# Altium schematic sheet Last project.SchDoc
size A; SheetNumber: 1; SheetTotal: 2
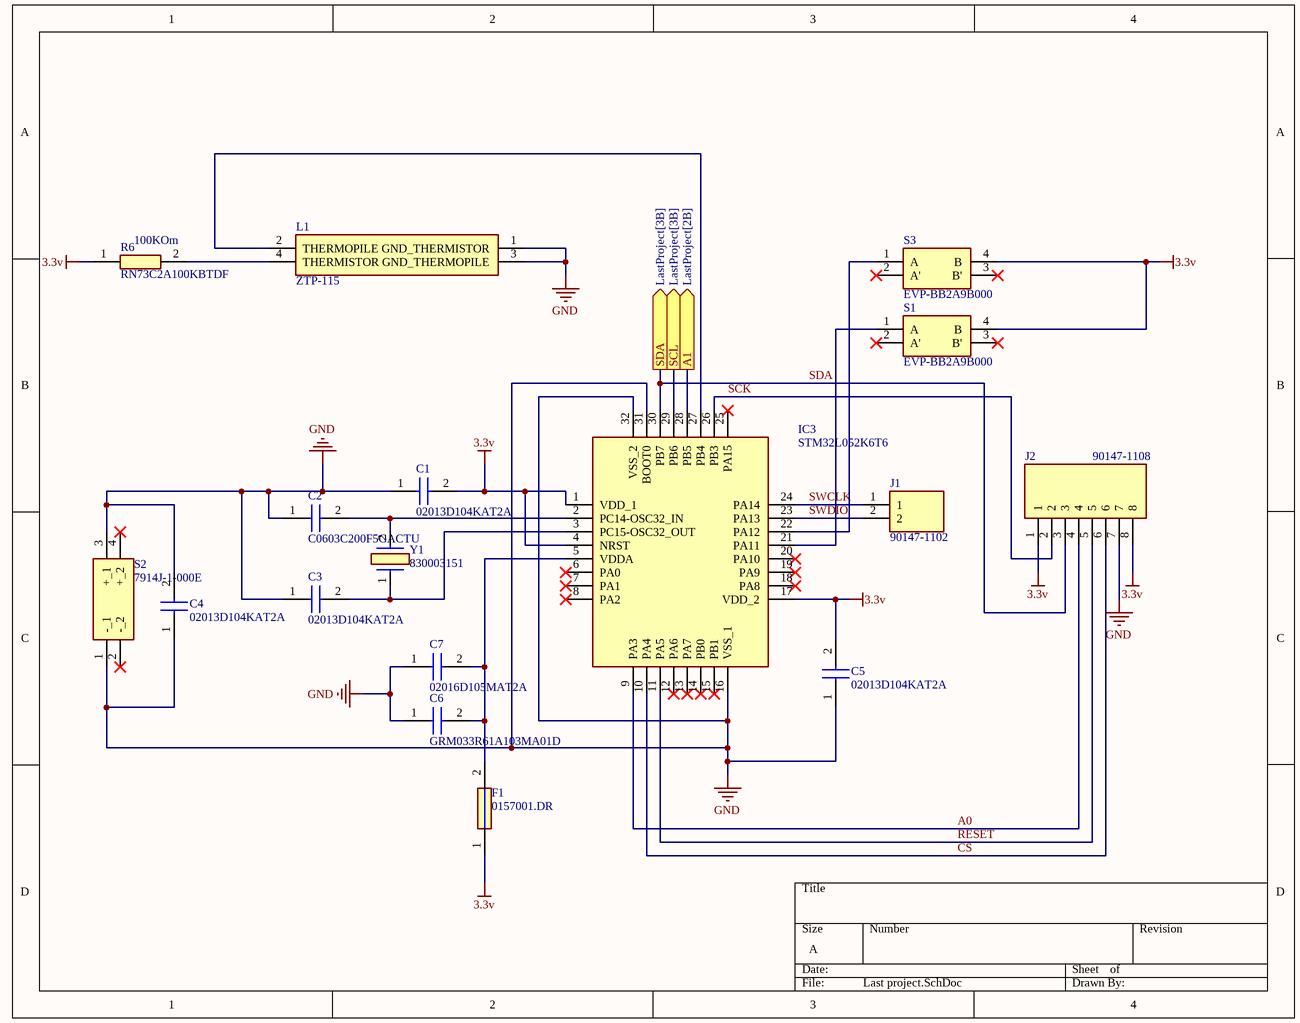
[diagram p0: Last project.SchDoc]

## Parts
C1  02013D104KAT2A  [CAPC0603X33N]
C2  C0603C200F5GACTU  [CAPC1608X87N]
C3  02013D104KAT2A  [CAPC0603X33N]
C4  02013D104KAT2A  [CAPC0603X33N]
C5  02013D104KAT2A  [CAPC0603X33N]
C6  GRM033R61A103MA01D  [GRM033D70J224ME01D]
C7  02016D105MAT2A  [CAPC0603X33N]
F1  0157001.DR  [FUSC6537X403N]
IC3  STM32L052K6T6  [QFP80P900X900X160-32N]
J1  90147-1102  [RHDR2W70P0X254_1X2_493X244X870P]
J2  90147-1108  [RHDR8W70P0X254_1X8_2017X244X870P]
L1  ZTP-115  [ZTP115]
R6  RN73C2A100KBTDF  [RESC2012X65N]
S1  EVP-BB2A9B000  [EVPBB2A9B000]
S2  7914J-1-000E  [7914J1000E]
S3  EVP-BB2A9B000  [EVPBB2A9B000]
Y1  830003151  [830003151]

## Ports
A1 (out, see LastProject[2B]), SCL (out, see LastProject[3B]), SDA (out, see LastProject[3B])

## Nets
3.3v: C1.2 C5.2 F1.1 IC3.1(VDD_1) IC3.4(NRST) IC3.17(VDD_2) J2.1 J2.8 R6.1 S1.4(B) S3.4(B)
GND: C1.1 C2.1 C3.1 C4.1 C4.2 C5.1 C6.1 C7.1 IC3.16(VSS_1) IC3.31(BOOT0) IC3.32(VSS_2) J2.7 L1.1(GND_THERMISTOR) L1.3(GND_THERMOPILE) S2.1(-_1) S2.3(+_1)
A0: IC3.9(PA3) J2.4
A1: IC3.28(PB5) ; port A1
CS: IC3.10(PA4) J2.6
RESET: IC3.11(PA5) J2.5
SCK: IC3.26(PB3) J2.2
SCL: IC3.29(PB6) ; port SCL
SDA: IC3.30(PB7) J2.3 ; port SDA
SWCLK: IC3.24(PA14) J1.1
SWDIO: IC3.23(PA13) J1.2
NetC2_2: C2.2 IC3.2(PC14-OSC32_IN) Y1.2
NetC3_2: C3.2 IC3.3(PC15-OSC32_OUT) Y1.1
NetC6_2: C6.2 C7.2 F1.2 IC3.5(VDDA)
NetIC3_21: IC3.21(PA11) S1.1(A)
NetIC3_22: IC3.22(PA12) S3.1(A)
NetIC3_27: IC3.27(PB4) L1.2(THERMOPILE)
NetL1_4: L1.4(THERMISTOR) R6.2

Not connected (* = marked no-connect by the designer): IC3 6(PA0)* 7(PA1)* 8(PA2)* 12(PA6)* 13(PA7)* 14(PB0)* 15(PB1)* 18(PA8)* 19(PA9)* 20(PA10)* 25(PA15)*; S1 2(A')* 3(B')*; S2 2(-_2)* 4(+_2)*; S3 2(A')* 3(B')*

## Notes on the sheet
- (near R6) 100KOm

## Library data of the parts
C1 C3-C5 = 02013D104KAT2A: Capacitor; Manufacturer_Name: Kyocera AVX; Datasheet Link: http://www.mouser.com/catalog/supplier/library/pdf/AVXSurfaceMountCeramic.pdf; Height: 0.33mm; Manufacturer_Part_Number: 02013D104KAT2A; Mouser Part Number: 581-02013D104KAT2A; Mouser Price/Stock: https://www.mouser.co.uk/ProductDetail/KYOCERA-AVX/02013D104KAT2A?qs=%252BdQmOuGyFcEnhMAg1ZoBSQ%3D%3D
C2 = C0603C200F5GACTU: Capacitor; Manufacturer_Name: KEMET; Datasheet Link: https://content.kemet.com/datasheets/KEM_C1003_C0G_SMD.pdf; Height: 0.87mm; Manufacturer_Part_Number: C0603C200F5GACTU; Mouser Part Number: 80-C0603C200F5GACTU; Mouser Price/Stock: https://www.mouser.co.uk/ProductDetail/KEMET/C0603C200F5GACTU?qs=gt1LBUVyoHmxLY5yAwiOrg%3D%3D; Arrow Part Number: C0603C200F5GACTU; Arrow Price/Stock: https://www.arrow.com/en/products/c0603c200f5gactu/kemet-corporation
C6 = GRM033R61A103MA01D: Capacitor; Manufacturer_Name: Murata Electronics; Datasheet Link: https://search.murata.co.jp/Ceramy/image/img/A01X/G101/ENG/GRM033R61A103MA01-01A.pdf; Height: 0.5mm; Manufacturer_Part_Number: GRM033R61A103MA01D; Mouser Part Number: 81-GRM033R61A103MA1D; Mouser Price/Stock: https://www.mouser.com/Search/Refine.aspx?Keyword=81-GRM033R61A103MA1D; Arrow Part Number: GRM033R61A103MA01D; Arrow Price/Stock: https://www.arrow.com/en/products/grm033r61a103ma01d/murata-manufacturing
C7 = 02016D105MAT2A: Capacitor; Manufacturer_Name: Kyocera AVX; Datasheet Link: http://www.mouser.com/catalog/supplier/library/pdf/AVXSurfaceMountCeramic.pdf; Height: 0.33mm; Manufacturer_Part_Number: 02016D105MAT2A; Mouser Part Number: 581-02016D105MAT2A; Mouser Price/Stock: https://www.mouser.co.uk/ProductDetail/KYOCERA-AVX/02016D105MAT2A?qs=RC%2FTMc7rOJYRv3ejaJ2Ykg%3D%3D; Arrow Part Number: 02016D105MAT2A; Arrow Price/Stock: https://www.arrow.com/en/products/02016d105mat2a/avx?region=nac
F1 = 0157001.DR: Fuse; Manufacturer_Name: LITTELFUSE; Datasheet Link: https://m.littelfuse.com/~/media/electronics/datasheets/fuses/littelfuse_fuse_157_datasheet.pdf.pdf; Height: 4.03mm; Manufacturer_Part_Number: 0157001.DR; Mouser Part Number: 576-0157001.DR; Mouser Price/Stock: https://www.mouser.co.uk/ProductDetail/Littelfuse/0157001.DR?qs=n5MbhIql%252BRnvbSAA7u9U9A%3D%3D; Arrow Part Number: 0157001.DR; Arrow Price/Stock: https://www.arrow.com/en/products/0157001.dr/littelfuse?region=nac
IC3 = STM32L052K6T6: Integrated Circuit; Manufacturer_Name: STMicroelectronics; Datasheet Link: https://www.st.com/resource/en/datasheet/stm32l052k6.pdf; Height: 1.6mm; Manufacturer_Part_Number: STM32L052K6T6; Mouser Part Number: 511-STM32L052K6T6; Mouser Price/Stock: https://www.mouser.co.uk/ProductDetail/STMicroelectronics/STM32L052K6T6?qs=s5SkPsIz108xCpQ1lakLfA%3D%3D; Arrow Part Number: STM32L052K6T6; Arrow Price/Stock: https://www.arrow.com/en/products/stm32l052k6t6/stmicroelectronics
J1 = 90147-1102: Connector; Manufacturer_Name: Molex; Datasheet Link: https://componentsearchengine.com/Datasheets/1/90147-1102.pdf; Height: 8.7mm; Manufacturer_Part_Number: 90147-1102; Mouser Part Number: 538-90147-1102; Mouser Price/Stock: https://www.mouser.co.uk/ProductDetail/Molex/90147-1102?qs=QESXi79X%252BKphYEszDmsGRw%3D%3D
J2 = 90147-1108: Connector; Manufacturer_Name: Molex; Datasheet Link: https://www.molex.com/pdm_docs/sd/901471102_sd.pdf; Height: 8.7mm; Manufacturer_Part_Number: 90147-1108; Mouser Part Number: 538-90147-1108; Mouser Price/Stock: https://www.mouser.co.uk/ProductDetail/Molex/90147-1108?qs=QESXi79X%252BKqiwXr7kUdEeg%3D%3D
L1 = ZTP-115: Inductor; Manufacturer_Name: Amphenol; Datasheet Link: https://datasheet.datasheetarchive.com/originals/distributors/DKDS-11/209215.pdf; Height: 3.75mm; Manufacturer_Part_Number: ZTP-115; Mouser Part Number: 527-ZTP-115-STD; Mouser Price/Stock: https://www.mouser.co.uk/ProductDetail/Amphenol-Advanced-Sensors/ZTP-115?qs=gBjjYPXQNsSHNPW3cDJJRQ%3D%3D; Arrow Part Number: ZTP-115; Arrow Price/Stock: https://www.arrow.com/en/products/ztp-115/amphenol
R6 = RN73C2A100KBTDF: Resistor; Manufacturer_Name: TE Connectivity; Datasheet Link: https://www.te.com/commerce/DocumentDelivery/DDEController?Action=srchrtrv&DocNm=8-1773459-4_ELEVATOR_ESCALATOR_SOLUTIONS&DocType=Data%20Sheet&DocLang=English&PartCntxt=1676142-2&DocFormat=pdf; Height: 0.65mm; Manufacturer_Part_Number: RN73C2A100KBTDF; Mouser Part Number: 279-RN73CA-100K; Mouser Price/Stock: https://www.mouser.co.uk/ProductDetail/TE-Connectivity-Holsworthy/RN73C2A100KBTDF?qs=b4vKS93X7SxCHHLyClRFsA%3D%3D; Arrow Part Number: RN73C2A100KBTDF; Arrow Price/Stock: https://www.arrow.com/en/products/rn73c2a100kbtdf/te-connectivity
S1 S3 = EVP-BB2A9B000: Switch; Manufacturer_Name: Panasonic; Datasheet Link: https://industrial.panasonic.com/ac/cdn/e/control/switch/light-touch/catalog/sw_lt_eng_2616s.pdf; Height: 0mm; Manufacturer_Part_Number: EVP-BB2A9B000; Mouser Part Number: 667-EVP-BB2A9B000; Mouser Price/Stock: https://www.mouser.co.uk/ProductDetail/Panasonic/EVP-BB2A9B000?qs=iHX4uCgIbgPa3HqgzZ6vLw%3D%3D; Arrow Part Number: EVP-BB2A9B000; Arrow Price/Stock: https://www.arrow.com/en/products/evp-bb2a9b000/panasonic?region=nac
S2 = 7914J-1-000E: Switch; Manufacturer_Name: Bourns; Datasheet Link: http://www.bourns.com/docs/Product-Datasheets/7914.pdf; Height: 4mm; Manufacturer_Part_Number: 7914J-1-000E; Mouser Part Number: 652-7914J-1-000E; Mouser Price/Stock: https://www.mouser.co.uk/ProductDetail/Bourns/7914J-1-000E?qs=kSSonJSvPGpYnPbRlGle1w%3D%3D; Arrow Part Number: 7914J-1-000E; Arrow Price/Stock: https://www.arrow.com/en/products/7914j-1-000e/bourns?region=europe
Y1 = 830003151: Crystal or Oscillator; Manufacturer_Name: Wurth Elektronik; Datasheet Link: https://www.we-online.com/catalog/datasheet/830003151.pdf; Height: 4.3mm; Manufacturer_Part_Number: 830003151; Mouser Part Number: 710-830003151; Mouser Price/Stock: https://www.mouser.co.uk/ProductDetail/Wurth-Elektronik/830003151?qs=2WXlatMagcHisY7XHApyYg%3D%3D